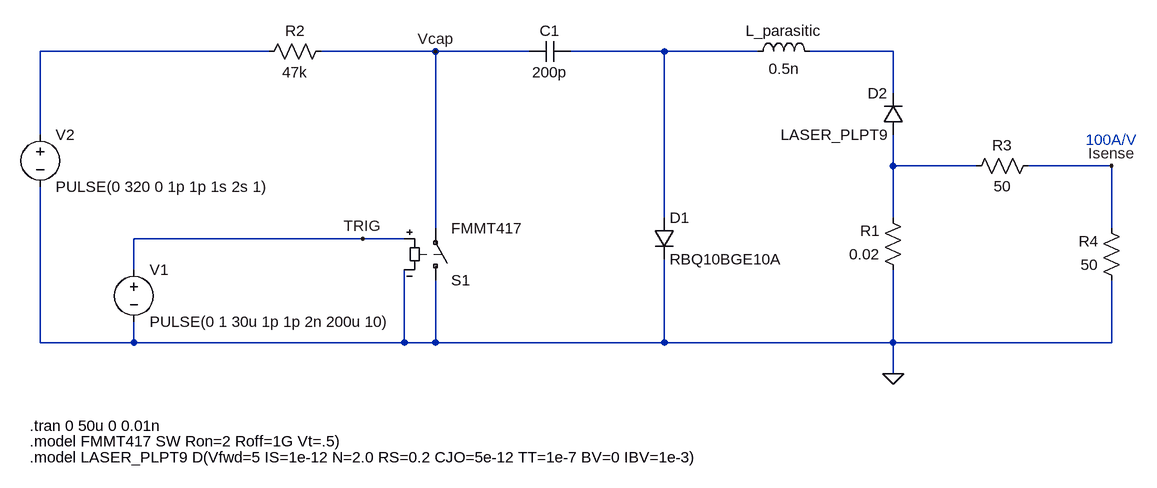
[diagram p0: schematic driver_circuit.asc]
driver_circuit.asc, the LTspice schematic file:
Version 4.1
SHEET 1 1656 900
WIRE 128 -240 -224 -240
WIRE 384 -240 208 -240
WIRE 528 -240 384 -240
WIRE 736 -240 592 -240
WIRE 880 -240 736 -240
WIRE 1088 -240 960 -240
WIRE 1088 -176 1088 -240
WIRE -224 -112 -224 -240
WIRE 1088 -64 1088 -112
WIRE 1216 -64 1088 -64
WIRE 1424 -64 1296 -64
WIRE 736 16 736 -240
WIRE 1088 16 1088 -64
WIRE 384 32 384 -240
WIRE 1424 32 1424 -64
WIRE 272 48 -80 48
WIRE 336 48 272 48
WIRE -80 96 -80 48
WIRE -224 208 -224 -32
WIRE -80 208 -80 176
WIRE -80 208 -224 208
WIRE 336 208 336 96
WIRE 336 208 -80 208
WIRE 384 208 384 112
WIRE 384 208 336 208
WIRE 736 208 736 80
WIRE 736 208 384 208
WIRE 1088 208 1088 96
WIRE 1088 208 736 208
WIRE 1424 208 1424 112
WIRE 1424 208 1088 208
WIRE 1088 256 1088 208
FLAG 1088 256 0
FLAG 384 -240 Vcap
FLAG 272 48 TRIG
FLAG 1424 -64 Isense
SYMBOL voltage -80 80 R0
WINDOW 123 0 0 Left 0
WINDOW 39 0 0 Left 0
SYMATTR InstName V1
SYMATTR Value PULSE(0 1 30u 1p 1p 2n 200u 10)
SYMBOL sw 384 128 M180
SYMATTR InstName S1
SYMATTR Value FMMT417
SYMBOL cap 528 -224 R270
WINDOW 0 32 32 VTop 2
WINDOW 3 0 32 VBottom 2
SYMATTR InstName C1
SYMATTR Value 200p
SYMBOL res 1104 112 R180
WINDOW 0 36 76 Left 2
WINDOW 3 36 40 Left 2
SYMATTR InstName R1
SYMATTR Value 0.02
SYMBOL res 112 -224 R270
WINDOW 0 32 56 VTop 2
WINDOW 3 0 56 VBottom 2
SYMATTR InstName R2
SYMATTR Value 47k
SYMBOL voltage -224 -128 R0
WINDOW 123 0 0 Left 0
WINDOW 39 24 124 Left 2
SYMATTR InstName V2
SYMATTR Value PULSE(0 320 0 1p 1p 1s 2s 1)
SYMBOL diode 720 16 R0
SYMATTR InstName D1
SYMATTR Value RBQ10BGE10A
SYMBOL res 1312 -80 R90
WINDOW 0 0 56 VBottom 2
WINDOW 3 32 56 VTop 2
SYMATTR InstName R3
SYMATTR Value 50
SYMBOL res 1440 128 R180
WINDOW 0 36 76 Left 2
WINDOW 3 36 40 Left 2
SYMATTR InstName R4
SYMATTR Value 50
SYMBOL diode 1104 -112 R180
WINDOW 0 24 64 Left 2
WINDOW 3 24 0 Left 2
SYMATTR InstName D2
SYMATTR Value LASER_PLPT9
SYMBOL ind 864 -224 R270
WINDOW 0 32 56 VTop 2
WINDOW 3 5 56 VBottom 2
SYMATTR InstName L_parasitic
SYMATTR Value 0.5n
SYMATTR SpiceLine Rser=1m
TEXT -240 336 Left 2 !.tran 0 50u 0 0.01n
TEXT -240 360 Left 2 !.model FMMT417 SW Ron=2 Roff=1G Vt=.5)
TEXT 1384 -104 Left 2 ;100A/V
TEXT -240 384 Left 2 !.model LASER_PLPT9 D(Vfwd=5 IS=1e-12 N=2.0 RS=0.2 CJO=5e-12 TT=1e-7 BV=0 IBV=1e-3)

The netlist it stands for:
* driver_circuit.asc
V1 TRIG 0 PULSE(0 1 30u 1p 1p 2n 200u 10)
S1 0 Vcap TRIG 0 FMMT417
C1 Vcap N002 200p
R1 0 N004 0.02
R2 N001 Vcap 47k
V2 N001 0 PULSE(0 320 0 1p 1p 1s 2s 1)
D1 N002 0 RBQ10BGE10A
R3 Isense N004 50
R4 0 Isense 50
D2 N004 N003 LASER_PLPT9
L_parasitic N002 N003 0.5n Rser=1m
.model D D
.lib standard.dio
.tran 0 50u 0 0.01n
.model FMMT417 SW Ron=2 Roff=1G Vt=.5)
* 100A/V
.model LASER_PLPT9 D(Vfwd=5 IS=1e-12 N=2.0 RS=0.2 CJO=5e-12 TT=1e-7 BV=0 IBV=1e-3)
.backanno
.end